# Altium schematic sheet Title Page.SchDoc
size A3; Company Name: Renesas Electronics America; CompanyURL: www.renesas.com; PageSetup: Record=PageOptions|CenterHorizontal=True|CenterVertical=True|PrintScale=1.00|XCorrection=1.00|YCorrection=1.00|PrintKind=1|BorderSize=5000000|LeftOffset=0|BottomOffset=0|Orientation=2|PaperLength=1000|PaperWidth=1000|Scale=100|PaperSource=7|PrintQuality=-4|MediaType=1|DitherType=10|PaperKind=A5 148x210mm|PrintScaleMode=1; ReleaseDate: 16.09.2025; Version: MP; SheetNumber: 1; SheetTotal: 18; VariantNumber: 0; DSheetNumber: 1
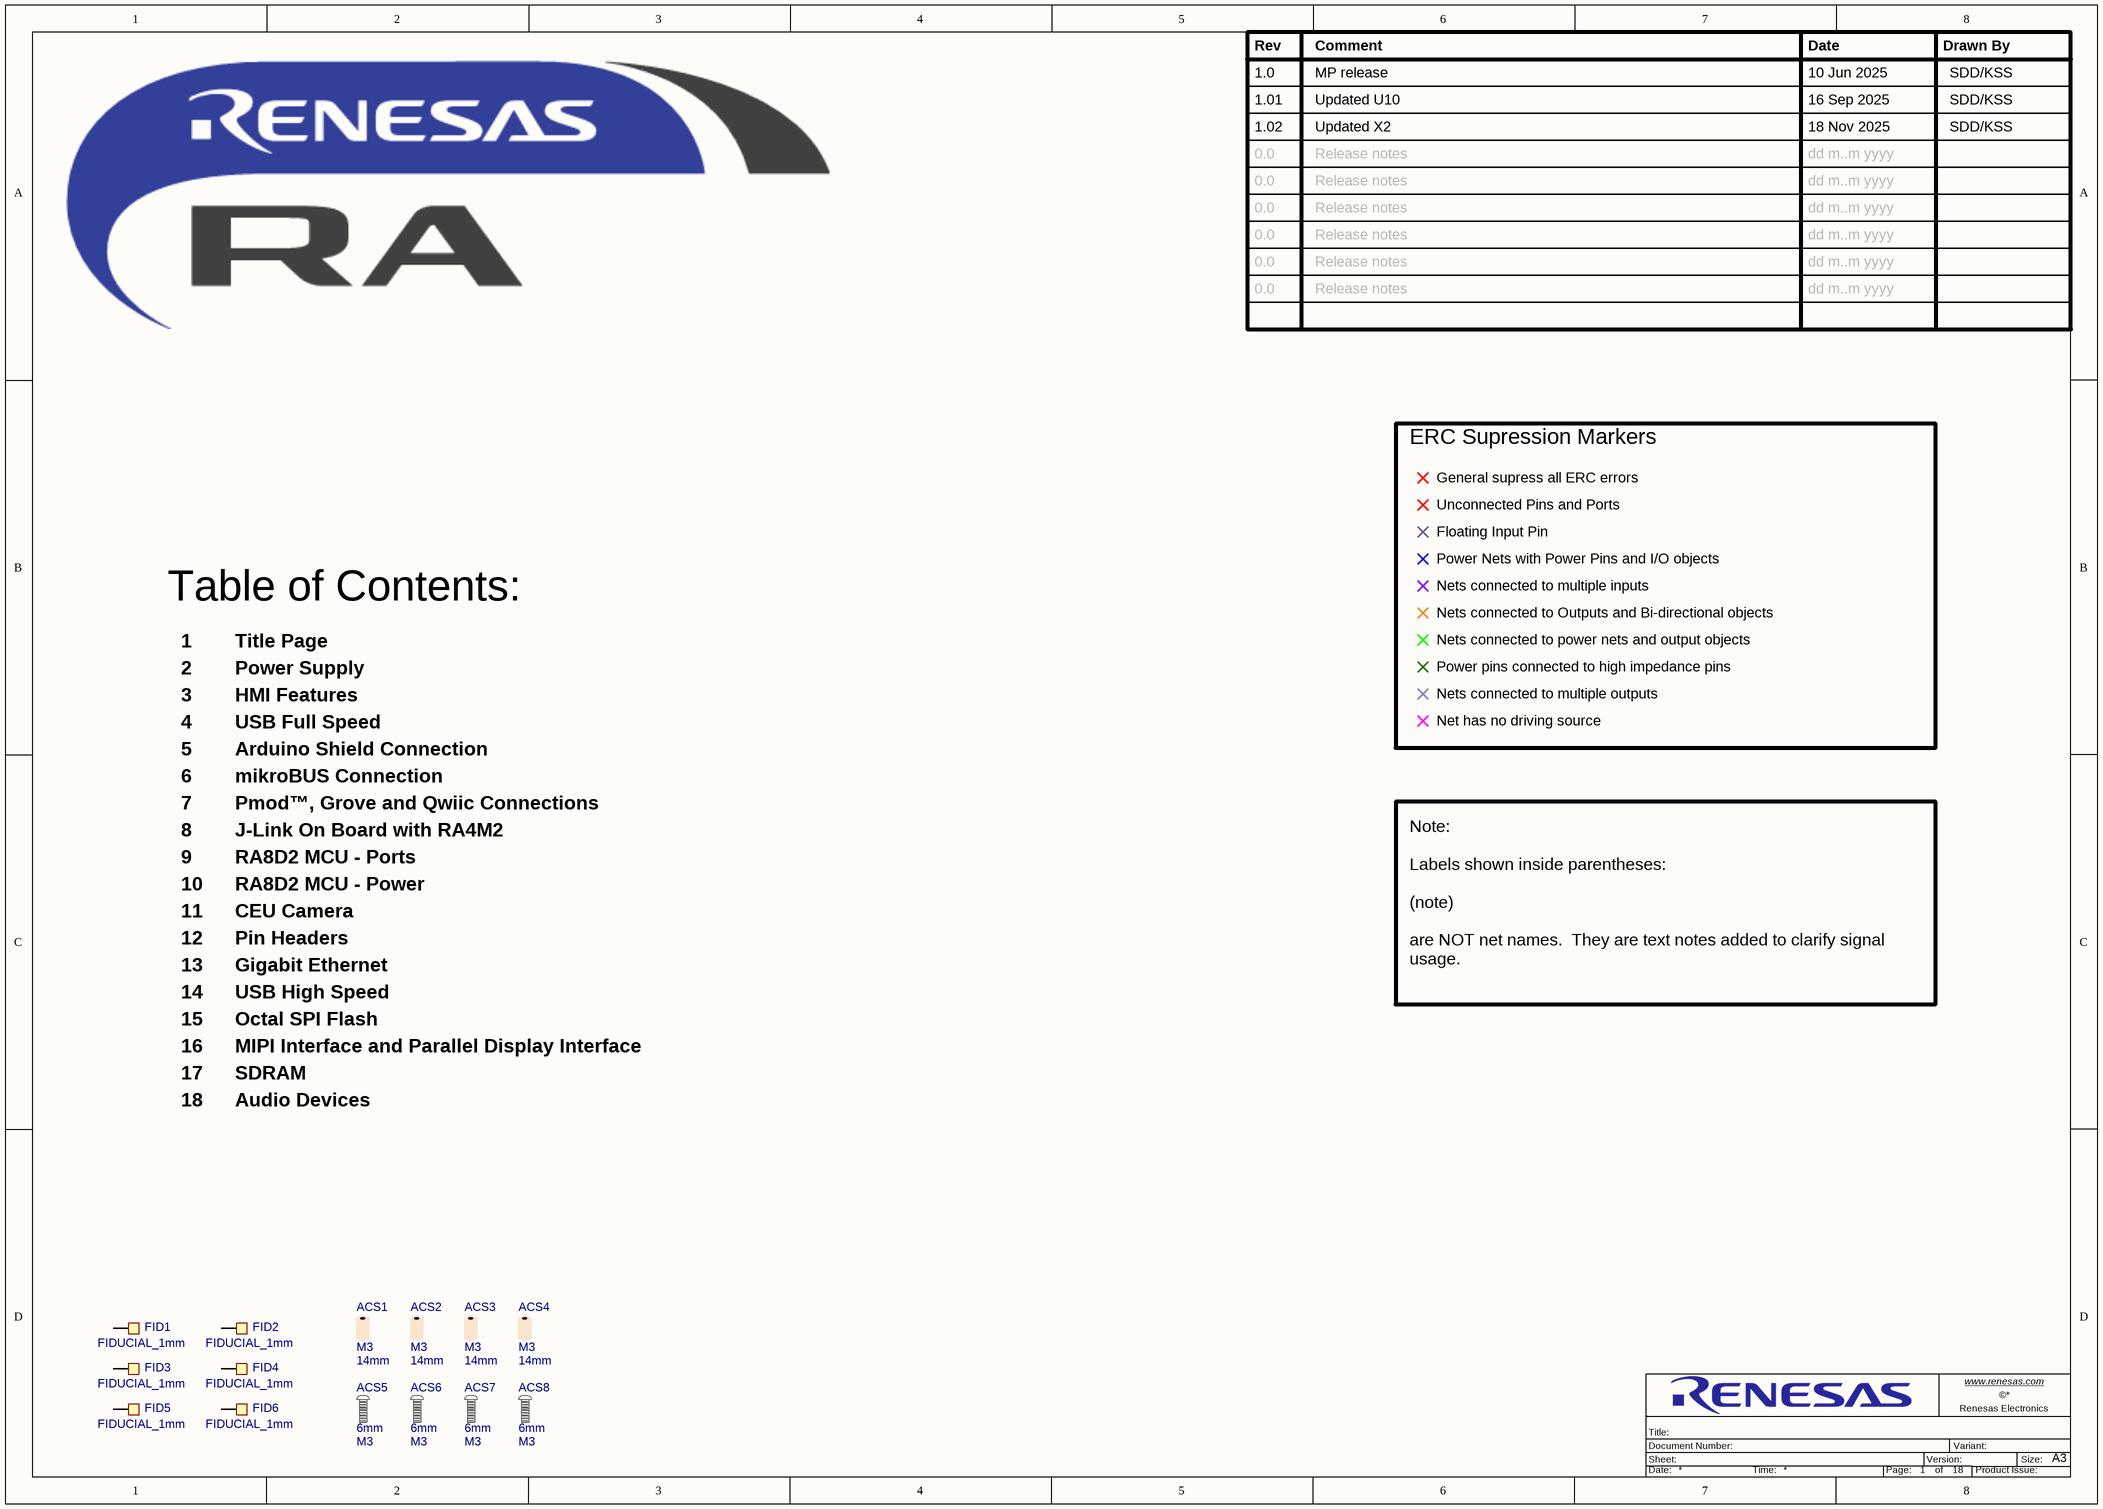
[diagram p0: Title Page.SchDoc]

## Parts
ACS1  Thread: M3  Length: 14mm  [standoff_6p0_M3x14x0p5_HexFemale]  (hidden comment: MTS-14)
ACS2  Thread: M3  Length: 14mm  [standoff_6p0_M3x14x0p5_HexFemale]  (hidden comment: MTS-14)
ACS3  Thread: M3  Length: 14mm  [standoff_6p0_M3x14x0p5_HexFemale]  (hidden comment: MTS-14)
ACS4  Thread: M3  Length: 14mm  [standoff_6p0_M3x14x0p5_HexFemale]  (hidden comment: MTS-14)
ACS5  Length: 6mm  Thread: M3  [screw_M3x0p5,6mm]  (hidden comment: 50M030050P006)
ACS6  Length: 6mm  Thread: M3  [screw_M3x0p5,6mm]  (hidden comment: 50M030050P006)
ACS7  Length: 6mm  Thread: M3  [screw_M3x0p5,6mm]  (hidden comment: 50M030050P006)
ACS8  Length: 6mm  Thread: M3  [screw_M3x0p5,6mm]  (hidden comment: 50M030050P006)
FID1  FIDUCIAL_1mm  [Fiducial_1mm]  (no BOM)
FID2  FIDUCIAL_1mm  [Fiducial_1mm]  (no BOM)
FID3  FIDUCIAL_1mm  [Fiducial_1mm]  (no BOM)
FID4  FIDUCIAL_1mm  [Fiducial_1mm]  (no BOM)
FID5  FIDUCIAL_1mm  [Fiducial_1mm]  (no BOM)
FID6  FIDUCIAL_1mm  [Fiducial_1mm]  (no BOM)

## Nets

Not connected (* = marked no-connect by the designer): FID1 1; FID2 1; FID3 1; FID4 1; FID5 1; FID6 1

## Notes on the sheet
- Rev
- Comment
- Date
- Drawn By
- 1.0
- 1.01
- MP release
- Updated U10
- 10 Jun 2025
- 16 Sep 2025
- SDD/KSS
- 0.0
- 1.02
- Release notes
- Updated X2
- dd m..m yyyy
- 18 Nov 2025
- ERC Supression Markers
- General supress all ERC errors
- Unconnected Pins and Ports
- Table of Contents:
- Floating Input Pin
- Power Nets with Power Pins and I/O objects
- Nets connected to multiple inputs
- 1
- Title Page
- Nets connected to Outputs and Bi-directional objects
- Nets connected to power nets and output objects
- 2
- 3
- Power Supply
- HMI Features
- Power pins connected to high impedance pins
- Nets connected to multiple outputs
- Net has no driving source
- 4
- 5
- 6
- USB Full Speed
- Arduino Shield Connection
- mikroBUS Connection
- 7
- 8
- Pmod™, Grove and Qwiic Connections
- J-Link On Board with RA4M2
- 9
- 10
- 11
- RA8D2 MCU - Ports
- RA8D2 MCU - Power
- CEU Camera
- 12
- 13
- Pin Headers
- Gigabit Ethernet
- 14
- 15
- 16
- USB High Speed
- Octal SPI Flash
- MIPI Interface and Parallel Display Interface
- Note:
  Labels shown inside parentheses:
  (note)
  are NOT net names.  They are text notes added to clarify signal usage.
- 17
- 18
- SDRAM
- Audio Devices
- www.renesas.com <http://www.renesas.com>
- Sheet:
- Title:
- Document Number:
- Version:
- Variant:
- Renesas Electronics
- Size:
- A3
- Date:
- Time:
- Page:
- of
- Product Issue:

## Library data of the parts
ACS1-ACS4 = ACS-00000000-5: Female Standoff; Nylon; Natural; M3; 14.0 mm Spacer; Width: 6mm; Subtype: Spacer; Material: Nylon Black
ACS5-ACS8 = ACS-00000005-4: Pan Phillips Screw, M3x0p5, Length 6mm, Natural, Nylon; Subtype: Screw; Material: Nylon Transparent
FID1-FID6 = MIS-00000006-3: Fiducial, 1mm, 0.5mm soldermask; Subtype: Testpoint; Value: TP; Qualification: -; Pin Count: 1